# EAGLE design untitled (EAGLE 8.3.2)
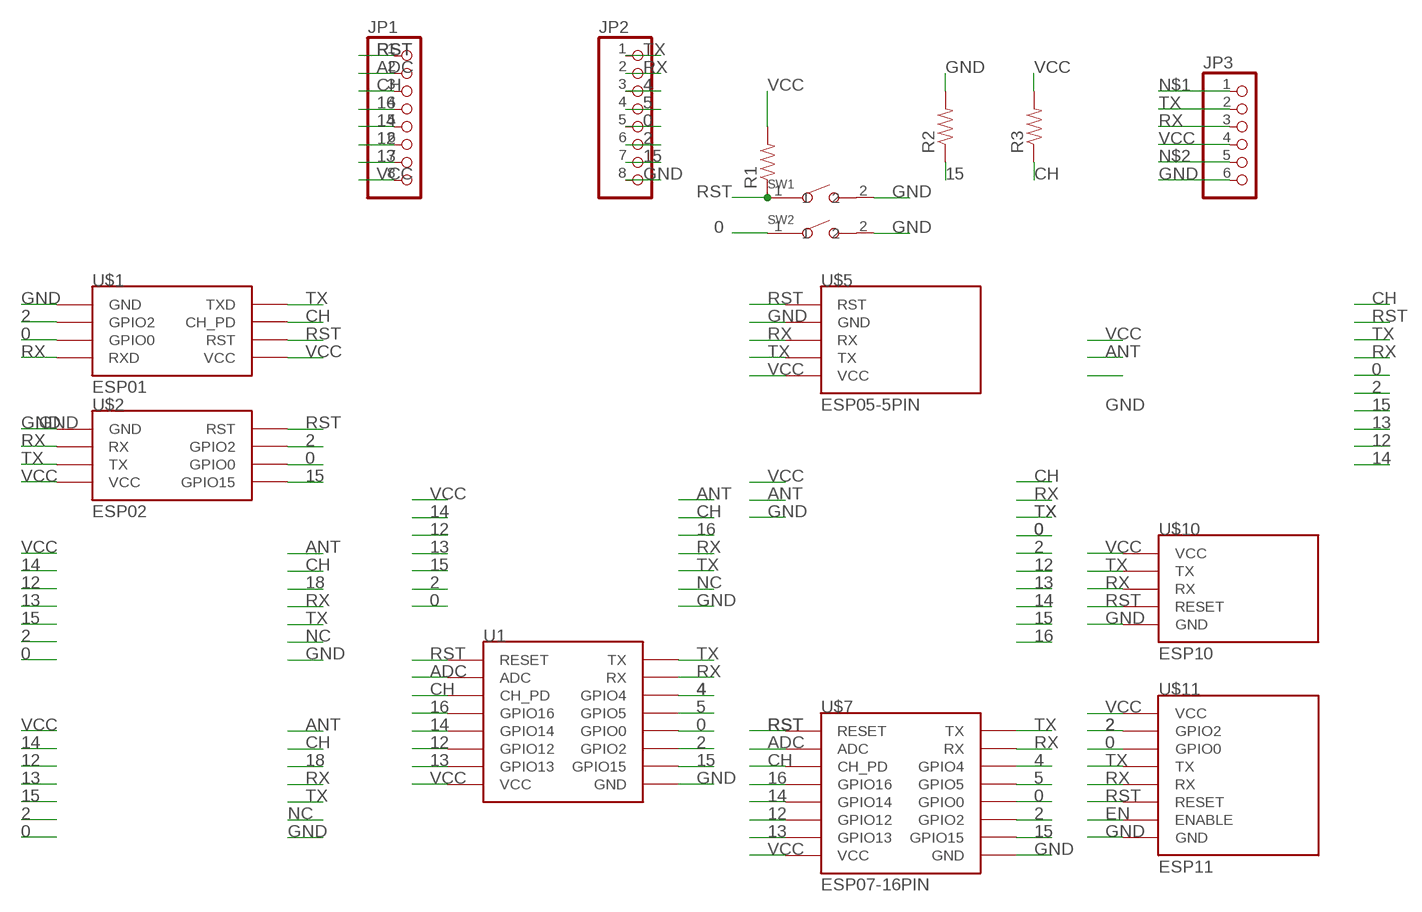
[diagram p0: schematic, sheet 1]

## Parts
JP1  PINHD-1X8  [1X08]
JP2  PINHD-1X8  [1X08]
JP3  PINHD-1X6  [1X06]
R1  RESISTOR1206  [1206]
R2  RESISTOR1206  [1206]
R3  RESISTOR1206  [1206]
SW1  SMD-BUTTON(2P-6.0X3.0X2.5MM)-DHT-1163S  [SW2-4.0-6.0X3.0X2.5MM]
SW2  SMD-BUTTON(2P-6.0X3.0X2.5MM)-DHT-1163S  [SW2-4.0-6.0X3.0X2.5MM]
U1  ESP12SMD  [ESP12-SMD]
U$1  ESP01  [ESP01]
U$2  ESP02  [ESP02]
U$5  ESP05-5PIN  [ESP05-5PIN]
U$7  ESP07-16PIN  [ESP07-16PIN]
U$10  ESP10  [ESP10]
U$11  ESP11  [ESP11]

## Nets
0: JP2.5 SW2.1 U1.GPIO0 U$1.GPIO0 U$2.GPIO0 U$7.GPIO0 U$11.P$6(GPIO0)
2: JP2.6 U1.GPIO2 U$1.GPIO2 U$2.GPIO2 U$7.GPIO2 U$11.P$7(GPIO2)
4: JP2.3 U1.GPIO4 U$7.GPIO4
5: JP2.4 U1.GPIO5 U$7.GPIO5
12: JP1.6 U1.GPIO12 U$7.GPIO12
13: JP1.7 U1.GPIO13 U$7.GPIO13
14: JP1.5 U1.GPIO14 U$7.GPIO14
15: JP2.7 R2.1 U1.GPIO15 U$2.GPIO15/POWERDOWN(GPIO15) U$7.GPIO15
16: JP1.4 U1.GPIO16 U$7.GPIO16
ADC: JP1.2 U1.ADC U$7.ADC
CH: JP1.3 R3.1 U1.CH_PD U$1.CH_PD U$7.CH_PD
EN: U$11.P$2(ENABLE)
GND: JP2.8 JP3.6 R2.2 SW1.2 SW2.2 U1.GND U$1.GND U$2.GND U$5.GND U$7.GND U$10.GND U$11.P$1(GND)
N$1: JP3.1
N$2: JP3.5
RST: JP1.1 R1.1 SW1.1 U1.RESET U$1.RST U$2.RST U$5.RST U$7.REST(RESET) U$10.RESET U$11.P$3(RESET)
RX: JP2.2 JP3.3 U1.RXD0(RX) U$1.RX(RXD) U$2.RX U$5.RX U$7.RX U$10.RX U$11.P$4(RX)
TX: JP2.1 JP3.2 U1.TXD0(TX) U$1.TX(TXD) U$2.TX U$5.TX U$7.TX U$10.TX U$11.P$5(TX)
VCC: JP1.8 JP3.4 R1.2 R3.2 U1.VCC U$1.VCC U$2.VCC U$5.VCC U$7.VCC U$10.VCC U$11.P$8(VCC)

## Library data of the parts
JP1 JP2 = pinhead:PINHD-1X8: PIN HEADER
JP3 = pinhead:PINHD-1X6: PIN HEADER
R1-R3 = SparkFun-Resistors:RESISTOR: Resistor Basic schematic elements and footprints for 0603, 1206, and PTH resistors.
SW1 SW2 = Seeed-OPL-Switch:SMD-BUTTON(2P-6.0X3.0X2.5MM): 311020029
U1 = esp8266modules:ESP12: ESP8266 Wifi module 12
U$1 = esp8266modules:ESP01: ESP8266 Wifi module 01
U$2 = esp8266modules:ESP02: ESP8266 Wifi module 02
U$5 = esp8266modules:ESP05-5PIN: ESP8266 Wifi module 05 - 5pin
U$7 = esp8266modules:ESP07-16PIN: ESP8266 Wifi module 07 - 16 pins; DIMENSIONS: 22.0 x 16.0 mm; PINS: 16; PITCH: 0.078" / 2 mm
U$10 = esp8266modules:ESP10: ESP8266 Wifi module 10
U$11 = esp8266modules:ESP11: ESP8266 Wifi module 11

## Board
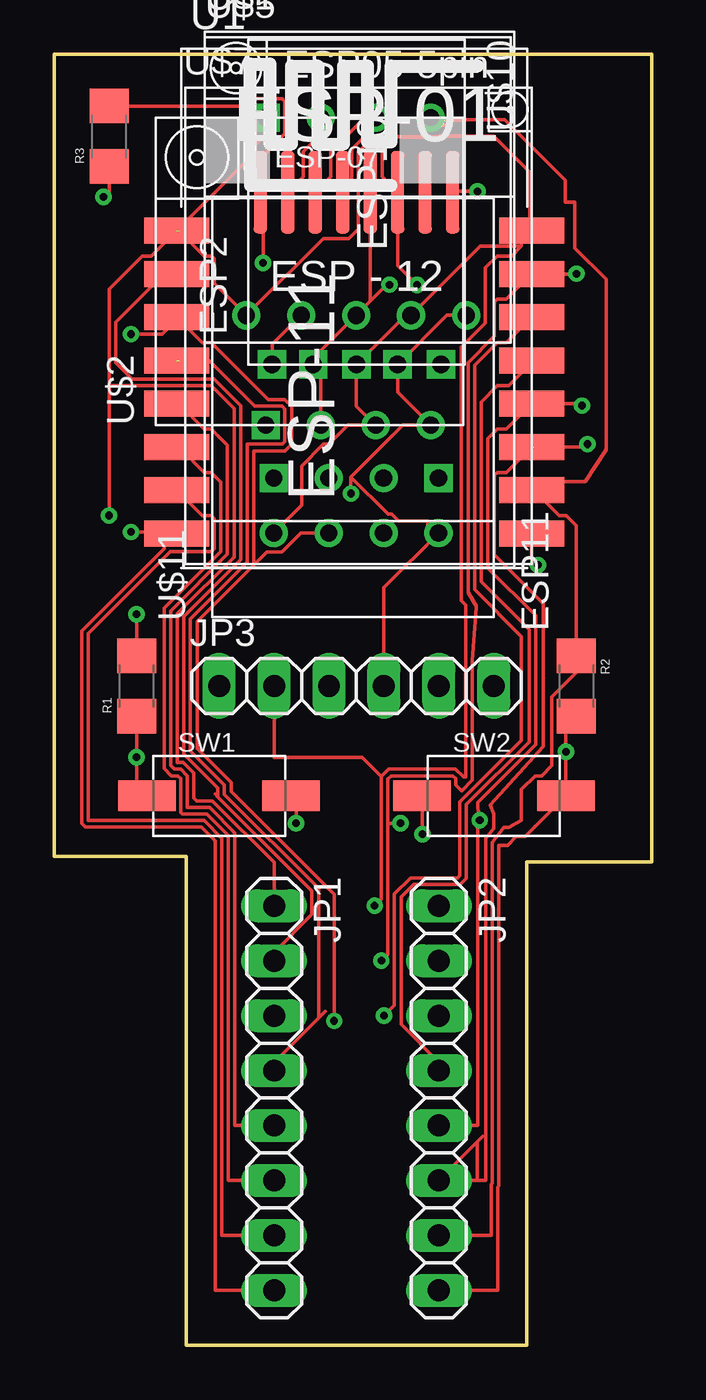
[diagram p1: board, top side]
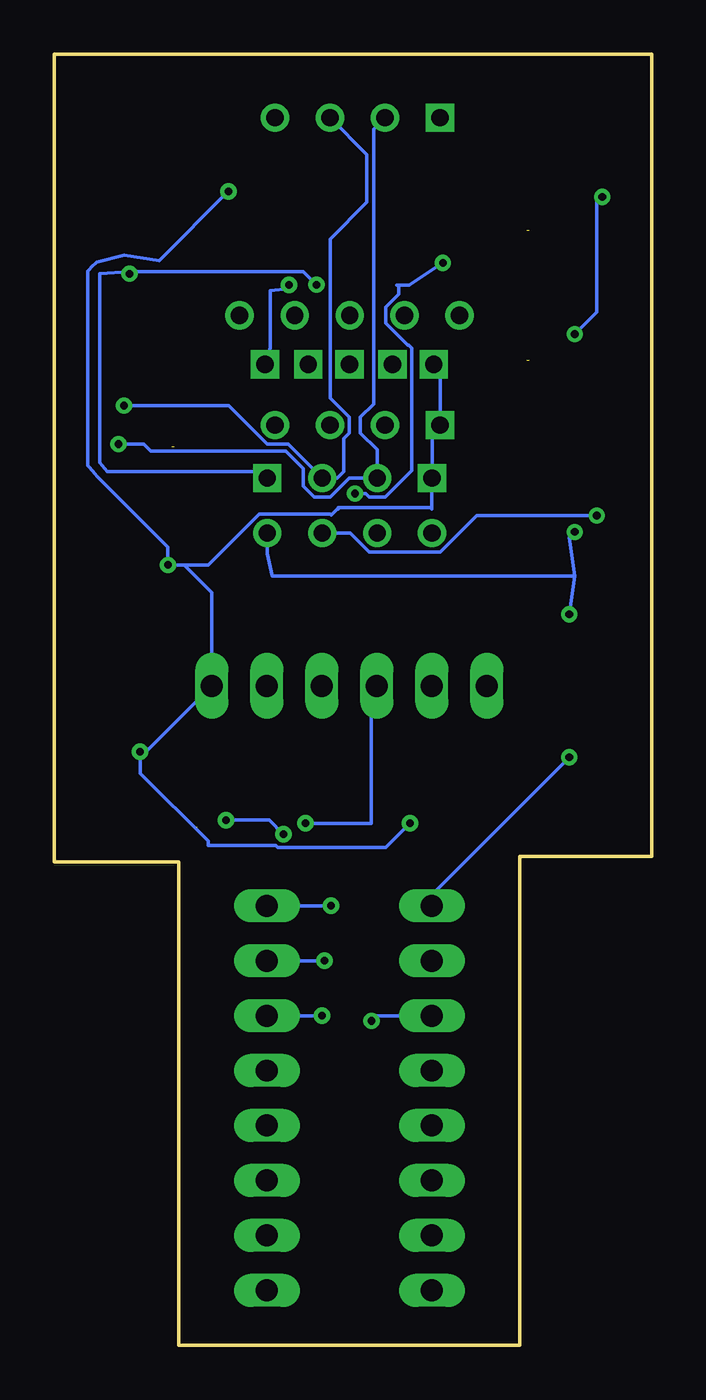
[diagram p2: board, bottom side, seen from below]

Size 27.61 x 59.68 mm. Coordinates in mm from the lower left corner, seen from the top.
Outline: 0,22.61 6.1,22.61 6.1,0 21.84,0 21.84,22.35 27.61,22.35 27.61,59.68 0,59.68 0,22.61
Copper layers (1*16): Top 0.035mm / dielectric 1.5mm / Bottom 0.035mm
Design rules "default": minimum track width 6mil, minimum drill 0.35mm, track to track 6mil, track to pad 6mil, pad to pad 6mil, via to via 6mil, smd to smd 6mil, copper to edge 40mil, drill to drill 6mil, minimum pad ring 10mil, minimum via ring 8mil, stop-mask expansion 4mil, vias tented up to drill 0mil, thermal gap 10mil

### Footprints (pad centres in the part's own frame; a part is rotated, then mirrored left to right if it is on the bottom)
1X08 = drill 1.016 long: 1 -8.89,0; 2 -6.35,0; 3 -3.81,0; 4 -1.27,0; 5 1.27,0; 6 3.81,0; 7 6.35,0; 8 8.89,0
1X06 = drill 1.016 long: 1 -6.35,0; 2 -3.81,0; 3 -1.27,0; 4 1.27,0; 5 3.81,0; 6 6.35,0
1206 = smd 1.6 x 1.8: 1 -1.4,0; 2 1.4,0
SW2-4.0-6.0X3.0X2.5MM = smd 2.65 x 1.4: 1 -3.325,0; 2 3.325,0
ESP12-SMD = smd 3 x 1.2: ADC -8.3,3.8; CH_PD -8.3,1.8; GND 8.1,-8.2; GPIO0 8.1,-2.2; GPIO2 8.1,-4.2; GPIO4 8.1,1.8; GPIO5 8.1,-0.2; GPIO12 -8.3,-4.2; GPIO13 -8.3,-6.2; GPIO14 -8.3,-2.2; GPIO15 8.1,-6.2; GPIO16 -8.3,-0.2; RESET -8.3,5.8; RXD0 8.1,3.8; TXD0 8.1,5.8; VCC -8.3,-8.2
ESP01 = drill 0.8: CH_PD -1.285,-8.178; GPIO0 1.255,-5.638; GPIO2 -1.285,-5.638; RST 1.255,-8.178; TX -3.825,-8.178; VCC 3.795,-8.178 | drill 0.8 square: GND -3.825,-5.638; RX 3.795,-5.638
ESP02 = drill 0.8 square: GND -7,2.92; RST 7.21,2.92 | drill 0.8: GPIO0 7.21,-2.16; GPIO2 7.21,0.38; GPIO15/POWERDOWN 7.21,-4.7; RX -7,0.38; TX -7,-2.16; VCC -7,-4.7
ESP05-5PIN = drill 0.8: GND -2.555,-5.73; RST -5.095,-5.73; RX -0.015,-5.73; TX 2.525,-5.73; VCC 5.074,-5.73
ESP07-16PIN = smd 2.5 x 1: ADC -8.2,3.8; CH_PD -8.2,1.8; GND 8.2,-8.105; GPIO0 8.2,-2.2; GPIO2 8.2,-4.2; GPIO4 8.2,1.8; GPIO5 8.2,-0.2; GPIO12 -8.2,-4.2; GPIO13 -8.2,-6.2; GPIO14 -8.2,-2.2; GPIO15 8.2,-6.2; GPIO16 -8.2,-0.2; REST -8.2,5.8; RX 8.2,3.8; TX 8.2,5.8; VCC -8.2,-8.105
ESP10 = drill 0.8 square: GND 8,-3.9; RESET 8,3.9; RX 8,-2; TX 8,0; VCC 8,1.9
ESP11 = smd 3.81 x 0.635: P$1 10.113,-4.445; P$2 10.113,-3.175; P$3 10.113,-1.905; P$4 10.113,-0.635; P$5 10.113,0.635; P$6 10.113,1.905; P$7 10.113,3.175; P$8 10.113,4.445

### Placement (x,y rotation side)
JP1  10.16,11.43 270 top
JP2  17.78,11.43 270 top
JP3  13.97,30.48 0 top
R1  3.81,30.48 90 top
R2  24.13,30.48 270 top
R3  2.54,55.88 90 top
SW1  7.62,25.4 0 top
SW2  20.32,25.4 0 top
U1  13.97,45.72 0 top
U$1  13.97,45.72 0 top
U$2  12.7,49.53 90 top
U$5  13.97,53.34 0 top
U$7  13.97,45.72 0 top
U$10  13.97,53.34 270 top
U$11  13.97,43.18 90 top

### Tracks (layer width: path | path; a pad name or v marks a point on that pad's centre or on a via)
0  (via drill 0.35)
  Top 0.152: JP2.5 19.58,10.16 19.58,24.28 v19.66,24.28 19.58,24.87 19.58,25.09 22.25,27.76 22.25,33.72 20.04,35.94 20.04,41.91 20.47,42.35 20.9,42.35 U1.GPIO0 U$7.GPIO0 24.3,43.52 v24.38,43.43 | U$11.P$6 12.79,54.02 12.79,55.17 14.36,56.74 U$2.GPIO0 | SW2.1 17.02,25.38 v17.02,23.62
  Bottom 0.152: U$2.GPIO0 13.16,55.04 13.16,52.83 14.85,51.14 14.85,43.77 13.98,42.9 13.98,42.16 14.22,41.92 14.22,40.39 14.53,40.08 U$1.GPIO0 16.79,41.65 17.77,41.65 19.55,43.43 v24.38,43.43 | v17.02,23.62 17.67,24.28 v19.66,24.28
2  (via drill 0.35)  (1 unrouted)
  Top 0.152: U$11.P$7 11.52,54.02 11.52,55.17 12.32,55.97 U$2.GPIO2 | v24.64,41.66 24.5,41.52 21.08,41.52 21.08,41.66 22.07,41.66 U1.GPIO2 20.9,40.35 20.47,40.35 20.34,40.21 20.34,36.55 22.61,34.29 22.61,27.69 20.15,24.98 | 19.56,9.4 JP2.6 19.56,7.62 | 19.56,9.4 19.81,9.65 | 20.15,24.98 | 20.15,24.98 20.32,24.56 20.32,23.9 19.94,23.42 19.94,7.62 19.56,7.62 | 19.56,9.4 19.56,7.62
  Bottom 0.152: v24.64,41.66 23.46,41.66 23.15,41.34 16.92,41.34 16.11,40.53 16.11,39.72 15.59,39.2 14.86,39.2 13.98,40.08 U$1.GPIO2 12.68,41.39 13.46,42.16 13.46,42.89 12.85,43.5 12.85,56.21 U$2.GPIO2
4  (via drill 0.35)
  Top 0.152: v15.24,15.24 15.72,15.72 15.72,20.86 16.48,21.61 18.64,21.61 18.75,21.72 18.75,25.12 21.58,27.95 21.58,32.77 19.43,34.92 19.43,45.3 20.47,46.35 20.9,46.35 U1.GPIO4 U$7.GPIO4
  Bottom 0.152: JP2.3 v15.24,15.24
5
  Top 0.152: JP2.4 17.78,13.08 16.03,14.83 16.03,20.73 16.61,21.31 18.77,21.31 19.05,21.59 19.05,24.99 21.95,27.89 21.95,33.09 19.73,35.3 19.73,43.6 20.47,44.35 21,44.35 U$7.GPIO5 U1.GPIO5
12
  Top 0.152: JP1.6 8.05,7.62 8.05,23.56 7.05,24.56 5.92,24.56 5.85,24.63 5.85,26.2 5.71,26.33 5.42,26.33 5.08,26.67 5.08,34.08 7.7,36.7 7.7,39.91 7.27,40.35 6.94,40.35 5.87,41.42 | 5.87,41.42 U$7.GPIO12 | U1.GPIO12 5.77,41.42 5.87,41.42
13
  Top 0.152: U$7.GPIO13 U1.GPIO13 6.84,38.35 7.27,38.35 7.4,38.21 7.4,36.82 7.27,36.69 5.37,36.69 1.57,32.89 1.57,24.26 6.93,24.26 7.75,23.44 7.75,5.08 JP1.7
14
  Top 0.152: JP1.5 8.36,10.16 8.36,23.69 7.18,24.87 6.15,24.87 6.15,26.32 5.84,26.63 5.55,26.63 5.38,26.8 5.38,33.95 8.01,36.57 8.01,41.6 7.27,42.35 6.94,42.35 U$7.GPIO14 U1.GPIO14
15  (1 unrouted)
  Top 0.152: JP2.7 20.19,5.08 20.19,7.44 20.24,7.49 20.24,23.25 20.78,23.93 21,23.93 | 21.01,23.93 21.59,24.26 21.59,25.69 22.22,26.33 22.52,26.33 23,26.81 23,29.97 24.13,31.1 R2.1 24.13,37.88 23.66,38.35 23.34,38.35 22.46,39.23 | 22.46,39.23 U$7.GPIO15 23.34,39.93 24.53,39.93 25.5,41.41 25.5,49.27 24.05,50.72 24.05,52.83 23.62,52.83 23.62,53.85 20.83,56.64 17.4,56.64 U$2.GPIO15/POWERDOWN | U$2.GPIO15/POWERDOWN 17.75,56.39 18.03,56.39 17.68,56.74 U$2.GPIO15/POWERDOWN | U1.GPIO15 22.36,39.23 22.46,39.23
16  (1 unrouted)
  Top 0.152: JP1.4 10.16,13.08 11.88,14.79 | 11.88,14.79 12.52,15.44 | 11.88,14.79 12.22,15.13 12.22,21.12 7.87,25.47 7.87,25.9 6.3,27.47 6.3,33.57 8.92,36.19 8.92,41.65 10.53,41.65 10.66,41.78 10.66,43.28 10.53,43.41 9.27,43.41 7.55,45.14 7.17,45.52 U1.GPIO16
ADC
  Top 0.152: JP1.2 10.16,18.16 11.91,19.91 11.91,21 7.56,25.34 | 7.56,25.34 7.43,25.48 | 7.56,25.34 7.56,25.77 5.99,27.34 5.99,33.7 8.62,36.32 8.62,43.43 7.39,44.65 3.61,44.65 2.84,45.41 2.84,47.3 5.08,49.53 U1.ADC U$7.ADC
CH  (via drill 0.35)
  Top 0.152: 9.23,36.07 9.23,41.34 10.65,41.34 10.97,41.66 10.97,43.41 10.65,43.72 9.9,43.72 7.27,46.35 6.84,46.35 U1.CH_PD U$7.CH_PD 4.99,46.74 v3.56,46.74 | 9.23,36.07 6.6,33.44 6.6,27.59 8.18,26.02 8.18,25.6 12.94,20.83 v12.94,15 | 9.23,36.07 9.82,36.66 10.51,36.66 11.39,37.54 U$1.CH_PD | v2.29,53.09 2.54,53.34 R3.1
  Bottom 0.152: v12.94,15 12.7,15.24 JP1.3 | v3.56,46.74 2.54,47.75 2.54,53.09 v2.29,53.09
GND  (via drill 0.35)
  Top 0.152: R2.2 23.64,28.59 v23.64,27.43 SW2.2 22.24,23.99 22.2,23.99 22.2,23.95 21.77,23.52 21.36,23.52 20.95,23.11 20.55,23.11 20.55,7.37 20.5,7.32 20.5,2.54 JP2.8 | U$5.GND 10.07,46.27 U$10.GND | v22.35,36.07 22.07,36.35 U1.GND U$7.GND | SW1.2 11.18,25.17 v11.18,24.13 | U$11.P$1 18.46,53.34 v19.56,53.34
  Bottom 0.152: U$10.GND 9.78,45.05 U$2.GND 10.14,42.16 U$1.GND 10.16,40.07 10.16,38.66 10.23,38.73 14.47,38.73 14.47,38.66 14.54,38.66 14.82,38.38 14.86,38.42 18.13,38.42 20.49,36.07 21.59,36.07 | 21.59,36.07 v22.35,36.07 22.35,36.9 25.63,40.17 25.7,40.26 25.7,40.27 25.97,40.59 26.06,40.67 26.06,40.68 26.07,40.69 26.06,40.81 26.06,49.52 26.06,49.63 26.06,49.64 26.06,49.65 25.97,49.73 25.9,49.82 25.89,49.82 25.65,50.06 24.38,50.39 22.76,50.14 v19.56,53.34 | 21.59,36.07 20.32,34.8 JP3.6 23.37,27.43 23.62,27.43 | 23.62,27.43 v23.64,27.43 | v11.18,24.13 12.29,23.02 17.27,23.02 17.37,23.11 20.5,23.11 20.5,23.31 23.62,26.44 23.62,27.43
RST  (via drill 0.35)  (1 unrouted)
  Top 0.152: R1.1 v3.81,27.18 3.81,25.88 SW1.1 | JP1.1 10.16,22.32 7.31,25.17 6.58,25.17 6.46,25.29 6.46,26.45 5.97,26.94 5.69,26.94 5.69,33.82 8.31,36.45 8.31,43.3 7.27,44.35 2.64,44.35 2.54,44.45 | 2.54,44.45 2.54,48.81 4.08,50.35 4.5,50.35 U1.RESET 8.98,54.83 8.98,55.17 9.78,55.97 U$2.RST | U$7.REST 6.94,50.35 7.27,50.35 7.4,50.21 7.4,49.09 U$5.RST 12.42,51.16 13.62,51.16 14.06,51.59 14.06,55.17 14.32,55.43 14.89,55.43 15.15,55.17 15.15,54.02 U$11.P$3 15.88,49.91 v16.76,49.02 | v2.54,38.35 2.54,44.45
  Bottom 0.152: v16.76,49.02 16.76,48.84 17.63,48.74 17.63,46.09 U$10.RESET | v3.81,27.18 10.16,20.83 JP1.1 | v2.54,38.35 8.09,38.35 9.78,36.66 13.05,36.66 13.93,37.54 U$1.RST
RX  (via drill 0.35)
  Top 0.152: v15.12,17.78 15.42,18.08 15.42,24.13 | 15.42,24.13 15.42,26.17 15.57,26.33 18.41,26.33 18.55,26.2 18.55,25.9 18.82,25.63 19.33,26.13 19.33,31.65 19.5,34.11 19.5,34.17 19.12,34.8 19.12,45.43 20.34,46.65 20.34,48.21 20.47,48.35 20.9,48.35 U1.RXD0 U$7.RX v24.12,49.52 v24.13,49.53 | U$2.RX 12.32,44.99 U$10.RX 11.97,45.62 U$5.RX 14.61,48.26 | 14.61,48.26 U$11.P$4 | 14.61,48.26 15.37,49.02 v15.49,49.02 | v16,24.13 15.42,24.13
  Bottom 0.152: v15.12,17.78 JP2.2 | U$1.RX 18.07,40.39 25.15,40.39 25.5,40.8 25.5,49.53 24.13,49.63 | 24.13,49.63 v24.13,49.53 | v15.49,49.02 16.1,49.63 24.13,49.63 | JP3.3 12.95,30.23 12.95,24.13 v16,24.13
TX  (via drill 0.35)
  Top 0.152: 15.11,26.3 15.45,26.63 18.54,26.63 18.91,26.26 19.02,26.26 19.02,34.21 18.82,34.42 18.82,46.13 19.93,47.24 19.93,49.8 20.47,50.35 21.14,50.35 21.59,50.8 | v14.81,20.32 15.11,20.62 15.11,26.3 | 21.59,50.8 21.59,51.04 21.98,51.43 | 21.98,51.43 U1.TXD0 U$7.TX | U$1.TX 11.43,38.83 11.43,40.64 12.44,41.65 12.69,41.65 13.57,42.53 U$2.TX 13.97,43.42 U$10.TX 16.24,47.61 U$5.TX 19.68,50.8 21.59,50.8 | U$11.P$5 13.75,53.71 13.75,55.29 14.32,55.86 17.77,55.86 17.79,55.88 20.32,55.88 21.98,54.22 21.98,51.43 | 15.11,26.3 14.23,27.18 10.16,27.18 JP3.2
  Bottom 0.152: JP2.1 v14.81,20.32
VCC  (via drill 0.35)
  Top 0.152: JP1.8 7.44,2.54 7.44,23.31 6.8,23.95 1.45,23.95 1.27,24.13 1.27,33.02 5.08,36.83 5.08,36.92 U$7.VCC U1.VCC 5.6,37.59 v3.56,37.59 | U$5.VCC 18.14,47.61 U$10.VCC 15.87,44.06 U$2.VCC 16.11,42.53 13.72,40.14 | JP3.4 15.24,35.02 U$1.VCC 17.27,37.54 17.27,38.1 15.92,38.1 15.59,38.42 15.43,38.42 13.72,40.14 | R3.2 8.69,57.28 9.03,57.62 10.53,57.62 10.66,57.49 10.66,55.99 9.53,54.85 U$11.P$8 9.65,53.17 v9.65,50.04 | R1.2 v3.81,33.78 | v13.72,39.37 13.72,40.14
  Bottom 0.152: v3.56,37.59 3.81,37.34 3.56,35.56 | 3.56,35.56 v3.81,33.78 3.81,33.53 | 3.56,35.56 17.53,35.56 17.77,36.59 U$1.VCC | v9.65,50.04 11.2,49 11.68,49 | 11.68,49 11.78,49 | v13.72,39.37 13.22,39.37 13.05,39.2 12.32,39.2 11.09,40.43 11.09,46.09 11.22,46.22 11.28,46.22 12.3,47.24 12.3,47.98 11.68,48.59 11.68,49